# Altium schematic sheet IR_COMMUNICATION.SchDoc: IR_COMMUNICATION
size 420 x 297 mm; Engineer: ALPER KORKMAZ; SheetNumber: 6; SheetTotal: 8; SHEET: 6
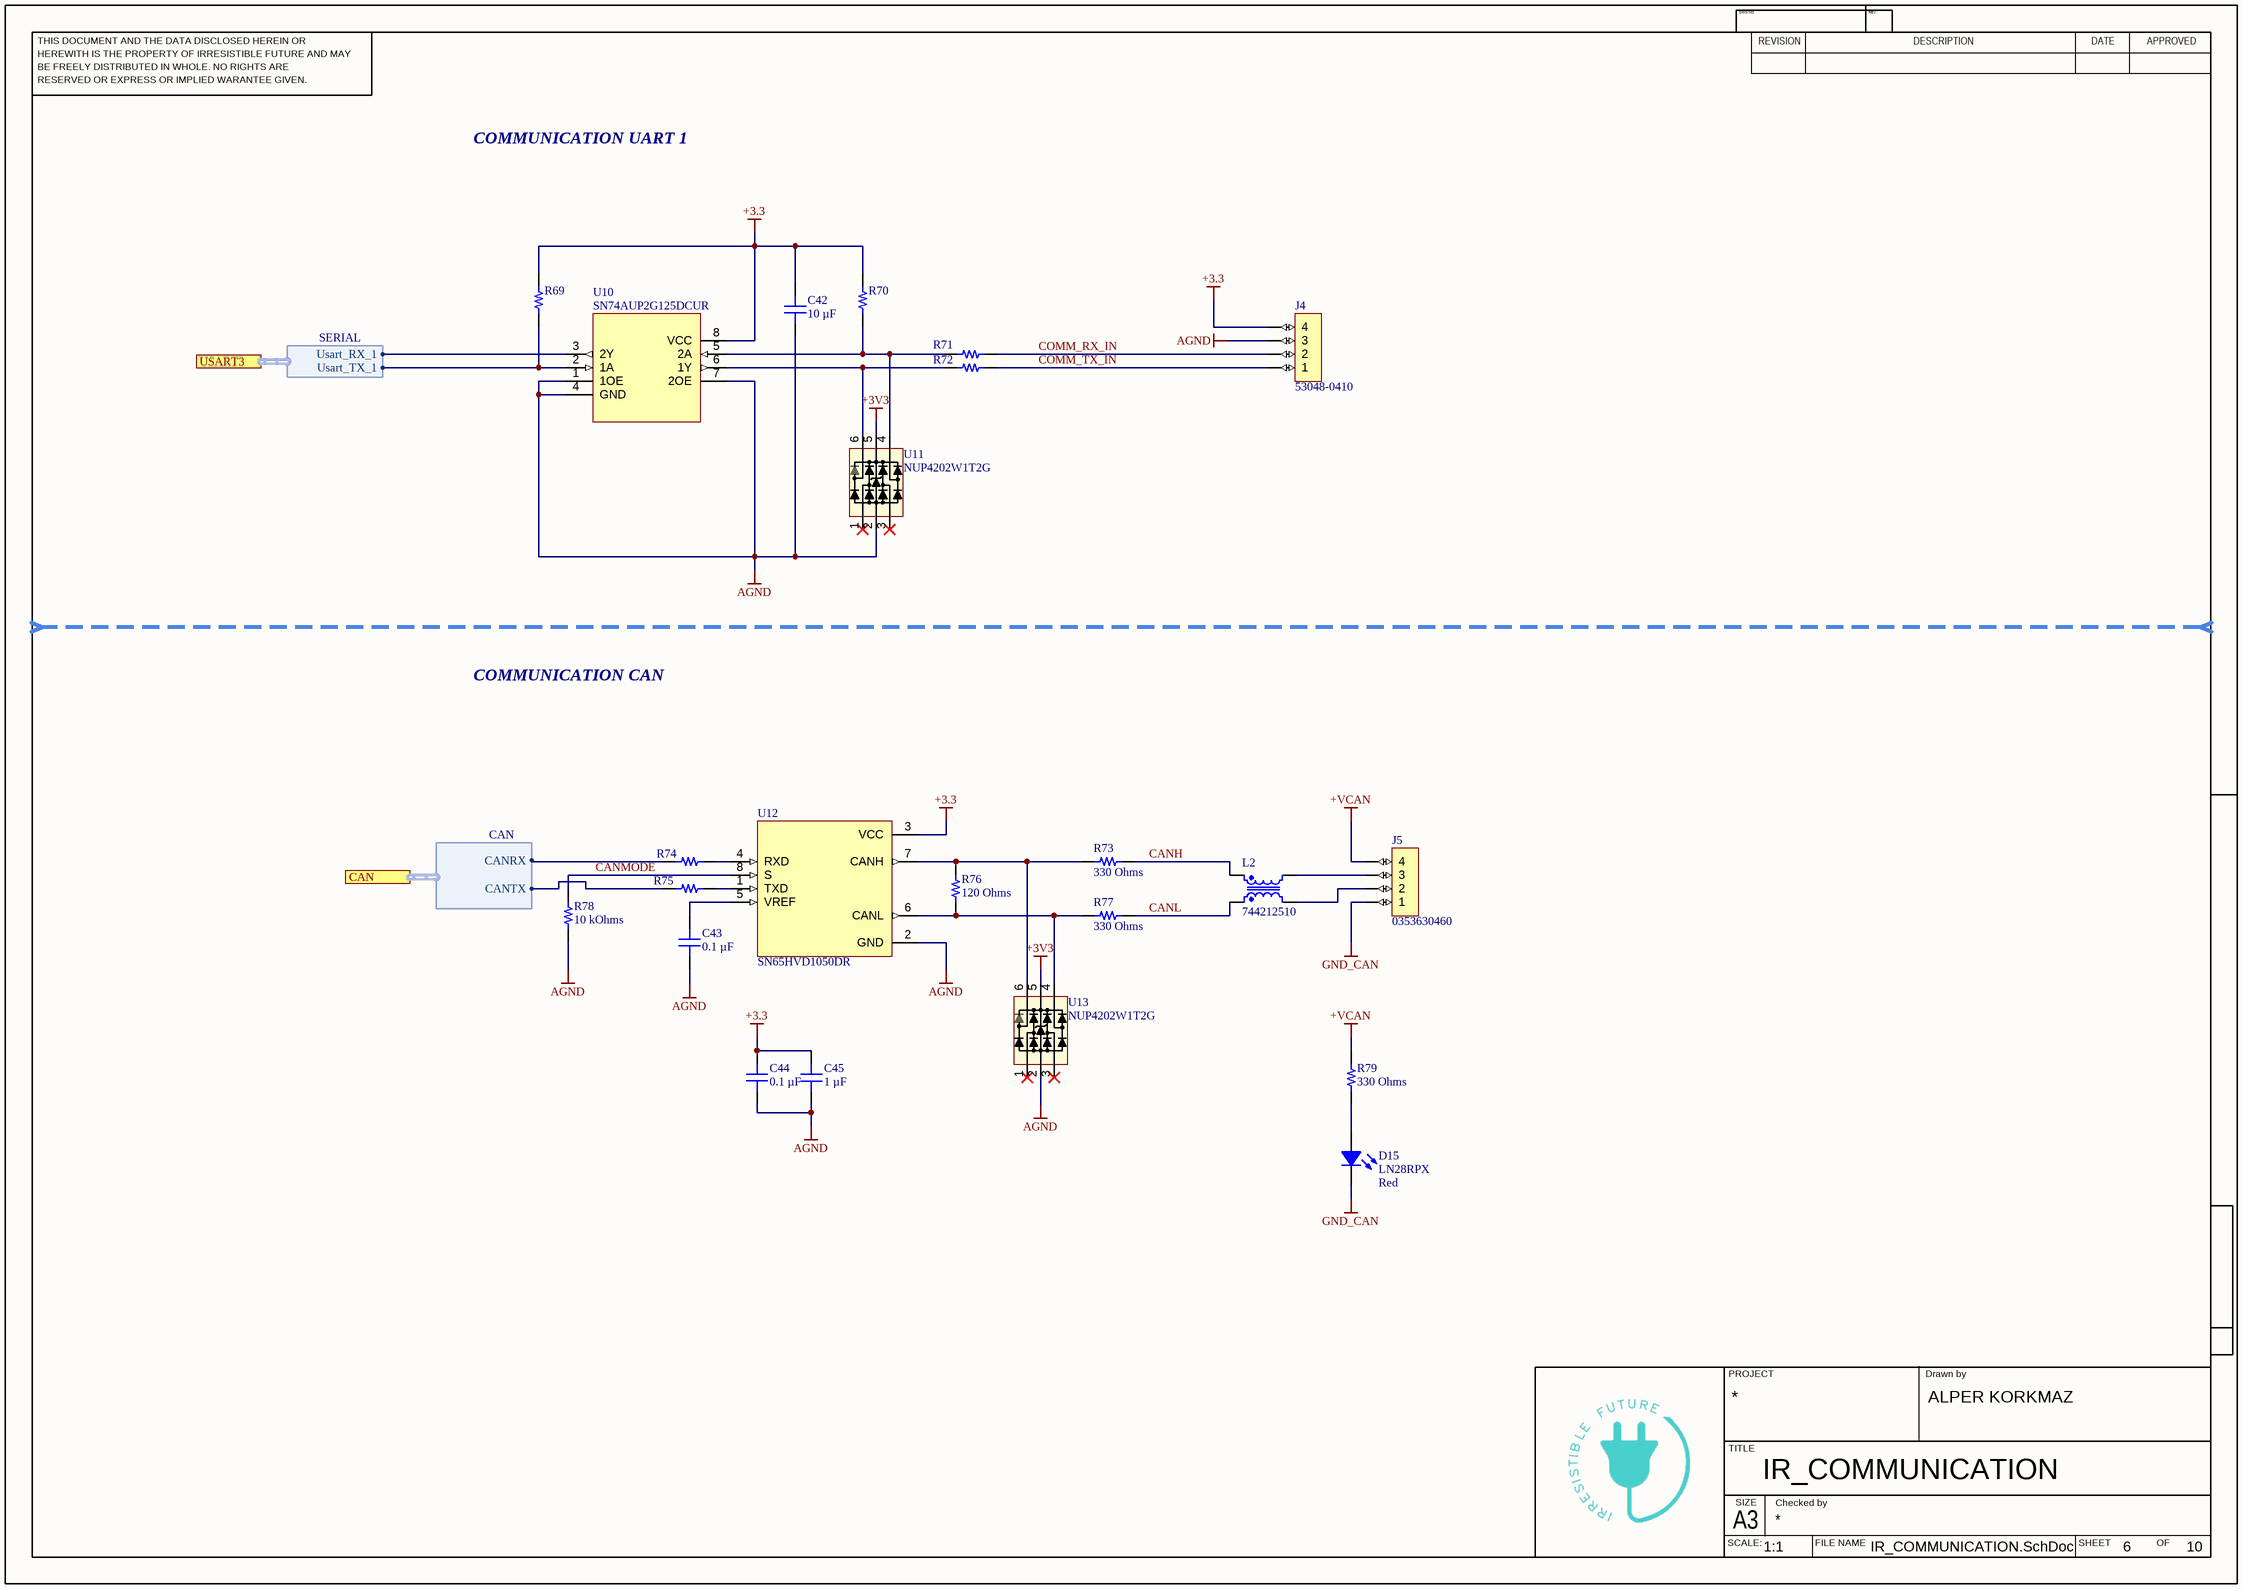
[diagram p0: IR_COMMUNICATION.SchDoc]

## Parts
C42  10 µF  [CAP 0603_1608]
C43  0.1 µF  [CAP 0603_1608]
C44  0.1 µF  [CAP 0603_1608]
C45  1 µF  [CAP 0603_1608]
D15  LN28RPX  Lens Color: Red  [Led-3mm-Red-h7]
J4  53048-0410  [CONN_4_POS__0530480410]
J5  0353630460  [CONN_4_POS__0353630460]
L2  744212510  [CM_6.50mm x 3.60mm]
R69  100 kOhms  [RES 0603_1608]  (value not drawn)
R70  100 kOhms  [RES 0603_1608]  (value not drawn)
R71  22 Ohms  [RES 0603_1608]  (value not drawn)
R72  22 Ohms  [RES 0603_1608]  (value not drawn)
R73  330 Ohms  [RES 0603_1608]
R74  22 Ohms  [RES 0603_1608]  (value not drawn)
R75  22 Ohms  [RES 0603_1608]  (value not drawn)
R76  120 Ohms  [RES 0603_1608]
R77  330 Ohms  [RES 0603_1608]
R78  10 kOhms  [RES 0603_1608]
R79  330 Ohms  [RES 0603_1608]
U10  SN74AUP2G125DCUR  [VFSOP_8]
U11  NUP4202W1T2G  [SOT-363]
U12  SN65HVD1050DR  [SOIC-8_L]
U13  NUP4202W1T2G  [SOT-363]

## Ports
CAN (harness CAN, see 1[1B], 3[5B]), USART3 (harness SERIAL, see 1[1B], 3[5B])

## Harnesses
SERIAL: Usart_RX_1, Usart_TX_1
CAN: CANRX, CANTX

## Nets
+3.3: C42.2 C44.2 C45.2 J4.4 R69.2 R70.2 U10.8(VCC) U12.3(VCC)
+3V3: U11.5 U13.5
+VCAN: J5.4 R79.2
AGND: C42.1 C43.1 C44.1 C45.1 J4.3 R78.1 U10.1(1OE) U10.4(GND) U10.7(2OE) U11.2 U12.2(GND) U13.2
GND_CAN: D15.2(K) J5.1
CANH: L2.3 R73.2
CANL: L2.1 R77.2
CANMODE: R78.2 U12.8(S)
COMM_RX_IN: J4.2 R71.2
COMM_TX_IN: J4.1 R72.2
NetC43_2: C43.2 U12.5(VREF)
NetD15_1: D15.1(A) R79.1
NetJ5_2: J5.2 L2.5
NetJ5_3: J5.3 L2.4
NetR69_1: R69.1 U10.2(1A) ; port USART3.Usart_TX_1
NetR70_1: R70.1 R71.1 U10.5(2A) U11.4
NetR72_1: R72.1 U10.6(1Y) U11.6
NetR73_1: R73.1 R76.2 U12.7(CANH) U13.6
NetR74_1: R74.1 ; port CAN.CANRX
NetR74_2: R74.2 U12.4(RXD)
NetR75_1: R75.1 ; port CAN.CANTX
NetR75_2: R75.2 U12.1(TXD)
NetR76_1: R76.1 R77.1 U12.6(CANL) U13.4
NetU10_3: U10.3(2Y) ; port USART3.Usart_RX_1

Not connected (* = marked no-connect by the designer): U11 1* 3*; U13 1* 3*

## Notes on the sheet
- COMMUNICATION UART 1
- COMMUNICATION CAN
- THIS DOCUMENT AND THE DATA DISCLOSED HEREIN OR
- HEREWITH IS THE PROPERTY OF IRRESISTIBLE FUTURE AND MAY
- DWG NO:
- REVISION
- REV:
- DESCRIPTION
- DATE
- APPROVED
- BE FREELY DISTRIBUTED IN WHOLE. NO RIGHTS ARE
- RESERVED OR EXPRESS OR IMPLIED WARANTEE GIVEN.
- PROJECT
- Drawn by
- TITLE
- SCALE:
- A3
- SIZE
- Checked by
- FILE NAME
- SHEET
- OF
- 1:1
- 10

## Library data of the parts
C42 = GRM188R60J106ME47D: CAP CER 10UF 6.3V X5R 0603; manufacturer: Murata Electronics; Tolerance: ±20%; Part Number: GRM188R60J106ME47D; Value: 10 µF; Applications: General Purpose; Capacitance: 10 µF; componentlink1description: Datasheet; componentlink1url: https://www.murata.com/~/media/webrenewal/support/library/catalog/products/capacitor/mlcc/c02e.ashx?la=en-us; componentlink2description: DigiKey Link; componentlink2url: https://www.digikey.com/en/products/detail/murata-electronics/GRM188R60J106ME47D/965910; Device Package: 0603 (1608 Metric); lastupdated: 13.07.2022 13:47:07; Lifecycle Status: Active; Minimum Order: 1; Mounting Type: Surface Mount, MLCC; Operating Temperature: -55°C ~ 85°C; Package / Case: 0603 (1608 Metric); packaging: TapeAndReel; partid: 2351; Part Status: Active; price: 0.03; series: GRM; Size / Dimension: 0.063" L x 0.031" W (1.60mm x 0.80mm); Supplier 1: DigiKey; Supplier Part Number 1: 490-3896-1-ND; Temperature Coefficient: X5R; Thickness (Max): 0.035" (0.90mm); Voltage - Rated: 6.3V
C43 C44 = C0603C104K5RECAUTO: CAP CER 0.10UF 50V X7R 0603; manufacturer: KEMET; Tolerance: ±10%; Part Number: C0603C104K5RECAUTO; Value: 0.1 µF; Applications: Automotive, ESD Protection; Capacitance: 0.1 µF; componentlink1description: Datasheet; componentlink1url: https://api.kemet.com/component-edge/download/datasheet/C0603C104K5RECAUTO.pdf; componentlink2description: DigiKey Link; componentlink2url: https://www.digikey.com/en/products/detail/kemet/C0603C104K5RECAUTO/6575893; Device Package: 0603 (1608 Metric); lastupdated: 13.07.2022 13:46:58; Lifecycle Status: Active; Minimum Order: 1; Mounting Type: Surface Mount, MLCC; Operating Temperature: -55°C ~ 125°C; Package / Case: 0603 (1608 Metric); packaging: TapeAndReel; partid: 6683; Part Status: Active; price: 0.04; Ratings: AEC-Q200; series: ESD SMD Auto X7R; Size / Dimension: 0.063" L x 0.031" W (1.60mm x 0.80mm); Supplier 1: DigiKey; Supplier Part Number 1: 399-14105-1-ND; Temperature Coefficient: X7R; Thickness (Max): 0.034" (0.87mm); Voltage - Rated: 50V
C45 = C0603C105K4RACAUTO: CAP CER 1UF 16V X7R 0603; manufacturer: KEMET; Tolerance: ±10%; Part Number: C0603C105K4RACAUTO; Value: 1 µF; Applications: Automotive, Bypass, Decoupling; Capacitance: 1 µF; componentlink1description: Datasheet; componentlink1url: https://api.kemet.com/component-edge/download/datasheet/C0603C105K4RACAUTO.pdf; componentlink2description: DigiKey Link; componentlink2url: https://www.digikey.com/en/products/detail/kemet/C0603C105K4RACAUTO/8635831; Device Package: 0603 (1608 Metric); lastupdated: 13.07.2022 13:47:07; Lifecycle Status: Active; Minimum Order: 1; Mounting Type: Surface Mount, MLCC; Operating Temperature: -55°C ~ 125°C; Package / Case: 0603 (1608 Metric); packaging: TapeAndReel; partid: 2179; Part Status: Active; price: 0.02; Ratings: AEC-Q200; series: SMD Auto X7R; Size / Dimension: 0.063" L x 0.031" W (1.60mm x 0.80mm); Supplier 1: DigiKey; Supplier Part Number 1: 399-17704-1-ND; Temperature Coefficient: X7R; Thickness (Max): 0.037" (0.95mm); Voltage - Rated: 16V
D15 = LED_RED__LN28RPX: LED RED DIFF 3MM ROUND T/H; Manufacturer: Panasonic Electronic Components; Lens Transparency: Diffused; Millicandela Rating: 2.8mcd; Lens Style/Size: Round with Domed Top, 3mm (T-1), 3.00mm; Voltage - Forward (Vf) (Typ): 2.2V; Current - Test: 15mA; Wavelength - Peak: 700nm; Manufacturer Part Number: LN28RPX; Category: Optoelectronics; Supplier: Digi-Key; RoHS: RoHS Compliant; Packaging: Bulk; Part Status: Not For New Designs; Color: Red; Viewing Angle: -; Mounting Type: Through Hole; Wavelength - Dominant: -; Features: -; Package / Case: Radial; Supplier Device Package: 3mm Round; Size / Dimension: -; Height (Max): 5.70mm; ComponentLink1URL: http://industrial.panasonic.com/www-cgi/jvcr13pz.cgi?E+SC+4+ATA7001+LN28RPX+8+WW; ComponentLink1Description: http://industrial.panasonic.com/www-cgi/jvcr13pz.cgi?E+SC+4+ATA7001+LN28RPX+8+WW; Pricing: 1=0.45, 10=0.326, 25=0.2664, 100=0.213, 250=0.17972, 500=0.15308, 1000=0.11981, 2500=0.10982, 5000=0.09984 (USD); Supplier Part Number: P563-ND
J4 = CONN_4_POS__0530480410: CONN HEADER R/A 4POS 1.25MM; Manufacturer: Molex; Contact Resistance: 20mR; Current Rating: 1A; Voltage Rating: 125V; Number of Positions: 4; Insulation Resistance: 100MR; Gender: Male; Connector Type: Blade Pin; Glow Wire Compliant: Non-compliant; Supplier 1: Avnet; Manufacturer Part Number: 53048-0410; Stock 1: 44; Pricing 1: 1=0.1232 (USD); Mount: Through Hole; Case/Package: 0410; Contact Material: Bronze,Tin; Contact Plating: Tin; Color: Natural; Housing Color: Natural; Housing Material: Nylon; Min Operating Temperature: -40°C; Max Operating Temperature: 85°C; Package Quantity: 5000; Number of Rows: 1; Packaging: Tray; Contact Gender: Male; Termination: Solder; Number of Contacts: 4; Orientation: Right Angle; Number of Circuits: 4; Voltage Rating (DC): 125V; Series: PicoBlade; Contact Type: Blade Pin; Pitch: 1.25mm; Depth: 5.5mm; Radiation Hardening: No; REACH SVHC: Unknown; Lead Free: Lead Free; Flammability Rating: UL94 V-0; RoHS Compliant: Yes; ComponentLink1URL: https://www.distrelec.biz/Web/Downloads/60/_e/gg116847-116860_e.pdf?mime=application%2Fpdf&src-supplier=Distrelec; ComponentLink1Description: https://www.distrelec.biz/Web/Downloads/60/_e/gg116847-116860_e.pdf?mime=application%2Fpdf&src-supplier=Distrelec; ComponentLink2URL: http://uk.rs-online.com/webdocs/1362/0900766b81362ba7.pdf?src-supplier=RSComponents; ComponentLink2Description: http://uk.rs-online.com/webdocs/1362/0900766b81362ba7.pdf?src-supplier=RSComponents; ComponentLink3URL: http://www.molex.com/webdocs/datasheets/pdf/en-us/0530480410_PCB_HEADERS.pdf?src-supplier=Avnet; ComponentLink3Description: http://www.molex.com/webdocs/datasheets/pdf/en-us/0530480410_PCB_HEADERS.pdf?src-supplier=Avnet; ComponentLink4URL: http://www.mouser.com/ds/2/276/0530480410_PCB_HEADERS-170930.pdf?src-supplier=Mouser; ComponentLink4Description: http://www.mouser.com/ds/2/276/0530480410_PCB_HEADERS-170930.pdf?src-supplier=Mouser; Supplier Part Number 1: 53048-0410
J5 = CONN_4_POS__0353630460: CONN HEADER 4POS 2MM R/A TIN; Manufacturer: Molex Connector Corporation; Shrouding: Shrouded - 4 Wall; Style: Board to Cable/Wire; Pitch - Mating: 0.079" (2.00mm); Material Flammability Rating: UL94 V-0; Contact Length - Mating: 0.145" (3.70mm); Contact Length - Post: 0.126" (3.20mm); Number of Positions Loaded: All; Number of Positions: 4; Insulation Color: Natural; Insulation Material: Polyamide (PA), Nylon; Contact Finish Thickness - Mating: 78.7µin (2.00µm); Insulation Height: 0.217" (5.51mm); Overall Contact Length: -; Part Status: Active; Current Rating: -; RoHS: RoHS Compliant; Ingress Protection: -; Contact Material: Brass; Contact Finish - Post: Tin; Termination: Kinked Pin, Solder; Mounting Type: Through Hole, Right Angle; Fastening Type: Locking Ramp; Row Spacing - Mating: -; Mated Stacking Heights: -; Features: -; Contact Shape: Square; Contact Type: Male Pin; Packaging: Bulk; Supplier: Digi-Key; Manufacturer Part Number: 0353630460; Category: Connectors, Interconnects; Contact Finish Thickness - Post: 78.7µin (2.00µm); Voltage Rating: -; Operating Temperature: -; Contact Finish - Mating: Tin; Number of Rows: 1; Connector Type: Header; Applications: Automotive, General Purpose; ComponentLink1URL: http://www.molex.com/pdm_docs/sd/353630460_sd.pdf; ComponentLink1Description: http://www.molex.com/pdm_docs/sd/353630460_sd.pdf; Pricing: 1=0.48, 10=0.455, 100=0.3184, 500=0.27294, 1000=0.22745, 5000=0.19496, 10000=0.18196 (USD); Supplier Part Number: WM18933-ND
L2 = CM__744212510: Common Mode Filters / Chokes WE-SL1 SMD Ln Filter 2x51uH 300ohm; Manufacturer: Wurth Electronics; Core Material: Ferrite; Inductance: 51uH; Number of Lines: 2; DC Resistance (DCR): 160mR; Current Rating: 300mA; Test Frequency: 100kHz; Inductance Tolerance: 50%; Voltage Rating (DC): 80V; Impedance: 300R; Supplier 1: Digi-Key; Manufacturer Part Number: 744212510; RoHS: Yes; Category: Fixed Inductors; Pricing 1: 1=4,37000, 10=4,31200, 50=3,89500, 100=3,75600, 500=3,47800 (USD); Mount: Surface Mount; Case/Package: SMD/SMT; Number of Pins: 4; Min Operating Temperature: -40°C; Max Operating Temperature: 105°C; Package Quantity: 1000; Packaging: Tape and Reel; Current: 300mA; Max DC Current: 300mA; Termination: SMD/SMT; Series: WE-SL1; Tolerance: 50%; Length: 6.5mm; Width: 0.142inch; Height: 1.65mm; Depth: 3.6mm; REACH SVHC: No SVHC; Lead Free: Lead Free; RoHS Compliant: Yes; ComponentLink1URL: https://datasheet.ciiva.com/11800/0900766b8059564e-11800467.pdf?src-supplier=RSComponents; ComponentLink1Description: https://datasheet.ciiva.com/11800/0900766b8059564e-11800467.pdf?src-supplier=RSComponents; ComponentLink2URL: https://datasheet.ciiva.com/6048/1735560-6048484.pdf?src-supplier=Farnell; ComponentLink2Description: https://datasheet.ciiva.com/6048/1735560-6048484.pdf?src-supplier=Farnell; ComponentLink3URL: https://datasheet.ciiva.com/1130/744212510-1130407.pdf?src-supplier=Newark; ComponentLink3Description: https://datasheet.ciiva.com/1130/744212510-1130407.pdf?src-supplier=Newark; ComponentLink4URL: https://datasheet.ciiva.com/4952/744212510-77598-4952687.pdf?src-supplier=Mouser; ComponentLink4Description: https://datasheet.ciiva.com/4952/744212510-77598-4952687.pdf?src-supplier=Mouser; ComponentLink5URL: https://datasheet.ciiva.com/7764/1735560-7764951.pdf?src-supplier=Element14; ComponentLink5Description: https://datasheet.ciiva.com/7764/1735560-7764951.pdf?src-supplier=Element14; ComponentLink6URL: https://datasheet.ciiva.com/6216/744212510-6216346.pdf?src-supplier=Digi-Key; ComponentLink6Description: https://datasheet.ciiva.com/6216/744212510-6216346.pdf?src-supplier=Digi-Key; ComponentLink7URL: https://datasheet.ciiva.com/22705/1735560-22705131.pdf?src-supplier=Element14; ComponentLink7Description: https://datasheet.ciiva.com/22705/1735560-22705131.pdf?src-supplier=Element14; ComponentLink8URL: https://datasheet.ciiva.com/6216/744212510-6216348.pdf?src-supplier=Digi-Key; ComponentLink8Description: https://datasheet.ciiva.com/6216/744212510-6216348.pdf?src-supplier=Digi-Key; Supplier Part Number 1: 732-3941-6-ND
R69 R70 = RNCS0603BKE100K: RES 100K OHM 0.1% 1/16W 0603; Manufacturer: Stackpole Electronics Inc; Power (Watts): 0.063W, 1/16W; Temperature Coefficient: ±25ppm/°C; Part Number: RNCS0603BKE100K; Value: 100 kOhms; ComponentLink1Description: Datasheet; ComponentLink1URL: https://www.seielect.com/catalog/sei-rncs_rnch.pdf; ComponentLink2Description: DigiKey Link; ComponentLink2URL: https://www.digikey.com/en/products/detail/stackpole-electronics-inc/RNCS0603BKE100K/1708835; Composition: Thin Film; Device Package: 0603 (1608 Metric); Features: Anti-Corrosive, Automotive AEC-Q200, Moisture Resistant; Height - Seated (Max): 0.022" (0.55mm); LastUpdated: 13.07.2022 14:08:49; Lifecycle Status: Active; Minimum Order: 1; Number of Terminations: 2; Operating Temperature: -55°C ~ 155°C; Package / Case: 0603 (1608 Metric); Packaging: TapeAndReel; PartId: 4849; Part Status: Active; Price: 0.08; Ratings: AEC-Q200; Resistance: 100 kOhms; Series: RNCS; Size / Dimension: 0.061" L x 0.031" W (1.55mm x 0.80mm); Supplier 1: DigiKey; Supplier Part Number 1: RNCS0603BKE100KCT-ND; Supplier Device Package: 0603; Tolerance: ±0.1%
R71 R72 R74 R75 = ERJ-3EKF22R0V: RES SMD 22 OHM 1% 1/10W 0603; Manufacturer: Panasonic Electronic Components; Power (Watts): 0.1W, 1/10W; Temperature Coefficient: ±100ppm/°C; Part Number: ERJ-3EKF22R0V; Value: 22 Ohms; ComponentLink1Description: Datasheet; ComponentLink1URL: https://industrial.panasonic.com/cdbs/www-data/pdf/RDA0000/AOA0000C304.pdf; ComponentLink2Description: DigiKey Link; ComponentLink2URL: https://www.digikey.com/en/products/detail/panasonic-electronic-components/ERJ-3EKF22R0V/1746340; Composition: Thick Film; Device Package: 0603 (1608 Metric); Features: Automotive AEC-Q200; Height - Seated (Max): 0.022" (0.55mm); LastUpdated: 13.07.2022 14:08:47; Lifecycle Status: Active; Minimum Order: 1; Number of Terminations: 2; Operating Temperature: -55°C ~ 155°C; Package / Case: 0603 (1608 Metric); Packaging: TapeAndReel; PartId: 5655; Part Status: Active; Price: 0.01; Ratings: AEC-Q200; Resistance: 22 Ohms; Series: ERJ-3EK; Size / Dimension: 0.063" L x 0.031" W (1.60mm x 0.80mm); Supplier 1: DigiKey; Supplier Part Number 1: P22.0HCT-ND; Supplier Device Package: 0603; Tolerance: ±1%
R73 R77 R79 = CRGH0603F330R: RES SMD 330 OHM 1% 1/5W 0603; Manufacturer: TE Connectivity Passive Product; Power (Watts): 0.2W, 1/5W; Temperature Coefficient: ±100ppm/°C; Part Number: CRGH0603F330R; Value: 330 Ohms; ComponentLink1Description: Datasheet; ComponentLink1URL: https://www.te.com/commerce/DocumentDelivery/DDEController?Action=srchrtrv&DocNm=1773204-1&DocType=DS&DocLang=English; ComponentLink2Description: DigiKey Link; ComponentLink2URL: https://www.digikey.com/en/products/detail/te-connectivity-passive-product/CRGH0603F330R/5586961; Composition: Thick Film; Device Package: 0603 (1608 Metric); Height - Seated (Max): 0.022" (0.55mm); LastUpdated: 13.07.2022 14:08:46; Lifecycle Status: Active; Minimum Order: 1; Number of Terminations: 2; Operating Temperature: -55°C ~ 155°C; Package / Case: 0603 (1608 Metric); Packaging: TapeAndReel; PartId: 5733; Part Status: Active; Price: 0.01; Resistance: 330 Ohms; Series: CRGH, Neohm; Size / Dimension: 0.063" L x 0.031" W (1.60mm x 0.80mm); Supplier 1: DigiKey; Supplier Part Number 1: A129541CT-ND; Supplier Device Package: 0603; Tolerance: ±1%
R76 = RMCF0603JT120R: RES 120 OHM 5% 1/10W 0603; Manufacturer: Stackpole Electronics Inc; Power (Watts): 0.1W, 1/10W; Temperature Coefficient: ±200ppm/°C; Part Number: RMCF0603JT120R; Value: 120 Ohms; ComponentLink1Description: Datasheet; ComponentLink1URL: https://www.seielect.com/catalog/sei-rmcf_rmcp.pdf; ComponentLink2Description: DigiKey Link; ComponentLink2URL: https://www.digikey.com/en/products/detail/stackpole-electronics-inc/RMCF0603JT120R/1757978; Composition: Thick Film; Device Package: 0603 (1608 Metric); Features: Automotive AEC-Q200; Height - Seated (Max): 0.022" (0.55mm); LastUpdated: 13.07.2022 14:08:46; Lifecycle Status: Active; Minimum Order: 1; Number of Terminations: 2; Operating Temperature: -55°C ~ 155°C; Package / Case: 0603 (1608 Metric); Packaging: CutTape; PartId: 5957; Part Status: Active; Price: 0.01; Ratings: AEC-Q200; Resistance: 120 Ohms; Series: RMCF; Size / Dimension: 0.061" L x 0.031" W (1.55mm x 0.80mm); Supplier 1: DigiKey; Supplier Part Number 1: RMCF0603JT120RCT-ND; Supplier Device Package: 0603; Tolerance: ±5%
R78 = RNCS0603BKE10K0: RES 10K OHM 0.1% 1/16W 0603; Manufacturer: Stackpole Electronics Inc; Power (Watts): 0.063W, 1/16W; Temperature Coefficient: ±25ppm/°C; Part Number: RNCS0603BKE10K0; Value: 10 kOhms; ComponentLink1Description: Datasheet; ComponentLink1URL: https://www.seielect.com/catalog/sei-rncs_rnch.pdf; ComponentLink2Description: DigiKey Link; ComponentLink2URL: https://www.digikey.com/en/products/detail/stackpole-electronics-inc/RNCS0603BKE10K0/1708836; Composition: Thin Film; Device Package: 0603 (1608 Metric); Features: Anti-Corrosive, Automotive AEC-Q200, Moisture Resistant; Height - Seated (Max): 0.022" (0.55mm); LastUpdated: 13.07.2022 14:08:49; Lifecycle Status: Active; Minimum Order: 1; Number of Terminations: 2; Operating Temperature: -55°C ~ 155°C; Package / Case: 0603 (1608 Metric); Packaging: TapeAndReel; PartId: 4838; Part Status: Active; Price: 0.08; Ratings: AEC-Q200; Resistance: 10 kOhms; Series: RNCS; Size / Dimension: 0.061" L x 0.031" W (1.55mm x 0.80mm); Supplier 1: DigiKey; Supplier Part Number 1: RNCS0603BKE10K0CT-ND; Supplier Device Package: 0603; Tolerance: ±0.1%
U10 = SN74AUP2G125DCUR: Low-Power Dual Bus Buffer Gate With 3-State Outputs 8-VSSOP -40 to 85; Manufacturer: Texas Instruments; Max Supply Voltage: 3.6V; Min Supply Voltage: 800mV; Propagation Delay: 6.5ns; Number of Elements: 2; Logic Function: Buffer,Inverting; Low Level Output Current: 4mA; Number of Input Lines: 4; Polarity: Non-Inverting; Number of Bits per Element: 1; High Level Output Current: -4mA; Quiescent Current: 500nA; Supplier 1: Avnet; Manufacturer Part Number: SN74AUP2G125DCUR; Stock 1: 0; Mount: Surface Mount; Case/Package: VSSOP; Number of Pins: 8; Min Operating Temperature: -40°C; Max Operating Temperature: 85°C; Package Quantity: 3000; Packaging: Tape and Reel; Number of Channels: 2; Number of Inputs: 2; Number of Outputs: 2; Number of Output Lines: 4; Number of Bits: 2; Output Type: 3-STATE; Series: 74AUP; Technology: CMOS; Lead Free: Lead Free; RoHS Compliant: Yes; ComponentLink1URL: http://www.ti.com/lit/ds/symlink/sn74aup2g125.pdf?src-supplier=Digi-Key; ComponentLink1Description: http://www.ti.com/lit/ds/symlink/sn74aup2g125.pdf?src-supplier=Digi-Key; ComponentLink2URL: http://www.ti.com/general/docs/lit/getliterature.tsp?genericPartNumber=SN74AUP2G125&&fileType=pdf&src-supplier=Avnet; ComponentLink2Description: http://www.ti.com/general/docs/lit/getliterature.tsp?genericPartNumber=SN74AUP2G125&&fileType=pdf&src-supplier=Avnet; Supplier Part Number 1: SN74AUP2G125DCUR
U11 U13 = NUP4202W1T2G: TVS DIODE 5VWM 14.5VC SOT363; Manufacturer: ON Semiconductor; Capacitance @ Frequency: 3pF @ 1MHz; Voltage - Reverse Standoff (Typ): 5V (Max); Voltage - Breakdown (Min): 6V; Power Line Protection: No; Current - Peak Pulse (10/1000µs): 28A (8/20µs); Power - Peak Pulse: 500W; Voltage - Clamping (Max) @ Ipp: 14.5V (Typ); Type: Steering (Rail to Rail); Operating Temperature: -40°C ~ 125°C (TJ); Supplier: Digi-Key; Applications: General Purpose; Manufacturer Part Number: NUP4202W1T2G; Packaging: Cut Tape (CT); Package / Case: 6-TSSOP, SC-88, SOT-363; Mounting Type: Surface Mount; RoHS: RoHS Compliant; Category: Circuit Protection; Supplier Device Package: SC-88/SC70-6/SOT-363; Part Status: Active; ComponentLink1URL: http://www.onsemi.com/pub_link/Collateral/NUP4202W1-D.PDF; ComponentLink1Description: http://www.onsemi.com/pub_link/Collateral/NUP4202W1-D.PDF; Pricing: 1=0.69, 10=0.595, 100=0.4441, 500=0.34896, 1000=0.26965 (USD); Stock: 8683; Supplier Part Number: NUP4202W1T2GOSCT-ND
U12 = SN65HVD1050DR: High-Speed CAN Transceiver with Silent Mode 8-SOIC -40 to 125; MF: Texas Instruments; Min Supply Voltage: 4.75V; Max Supply Voltage: 5.25V; Data Rate: 1Mbps; Number of Transceivers: 1; Operating Supply Voltage: 5V; Nominal Supply Current: 70mA; Purchase-URL: https://pricing.snapeda.com/search/part/SN65HVD1050DR/?ref=eda; Digi-Key_Part_Number: 296-26335-1-ND; MP: SN65HVD1050DR; Check_prices: https://www.snapeda.com/parts/SN65HVD1050DR/Texas%20Instruments/view-part/1043210/?ref=eda; SnapEDA_Link: https://www.snapeda.com/parts/SN65HVD1050DR/Texas%20Instruments/view-part/1043210/?ref=snap; Value: *; Package: SOIC-8 Texas Instruments; Supplier 1: Digi-Key; Manufacturer: Texas Instruments; Manufacturer Part Number: SN65HVD1050DR; RoHS: Yes; Category: Interface ICs; Pricing 1: 1=1,69000, 10=1,51300, 25=1,43640, 100=1,18000, 250=1,10304, 500=0,97478, 1000=0,84700 (USD); Case/Package: D; Number of Pins: 8; Weight: 0.002677oz; Contact Plating: Gold; Min Operating Temperature: -40°C; Max Operating Temperature: 125°C; Packaging: Tape and Reel; Package Quantity: 2500; Max Supply Current: 70mA; Number of Drivers: 1; Number of Receivers: 1; Series: -; Supply Current: 70mA; Number of Transmit Buffers: 1; Number of Receive Buffers: 1; Radiation Hardening: No; Lead Free: Lead Free; RoHS Compliant: Yes; REACH SVHC: No SVHC; ComponentLink1URL: https://datasheet.ciiva.com/26828/sn65hvd1050dr-26828644.pdf?src-supplier=IIIC; ComponentLink1Description: https://datasheet.ciiva.com/26828/sn65hvd1050dr-26828644.pdf?src-supplier=IIIC; ComponentLink2URL: https://datasheet.ciiva.com/46392/1888948-46392549.pdf?src-supplier=Element14; ComponentLink2Description: https://datasheet.ciiva.com/46392/1888948-46392549.pdf?src-supplier=Element14; ComponentLink3URL: https://datasheet.ciiva.com/1701/sn65hvd1050-1701693.pdf?src-supplier=Digi-Key; ComponentLink3Description: https://datasheet.ciiva.com/1701/sn65hvd1050-1701693.pdf?src-supplier=Digi-Key; ComponentLink4URL: https://datasheet.ciiva.com/1701/sn65hvd1050-1701694.pdf?src-supplier=Digi-Key; ComponentLink4Description: https://datasheet.ciiva.com/1701/sn65hvd1050-1701694.pdf?src-supplier=Digi-Key; ComponentLink5URL: https://datasheet.ciiva.com/1701/sn65hvd1050-1701695.pdf?src-supplier=Digi-Key; ComponentLink5Description: https://datasheet.ciiva.com/1701/sn65hvd1050-1701695.pdf?src-supplier=Digi-Key; Supplier Part Number 1: 296-26335-6-ND